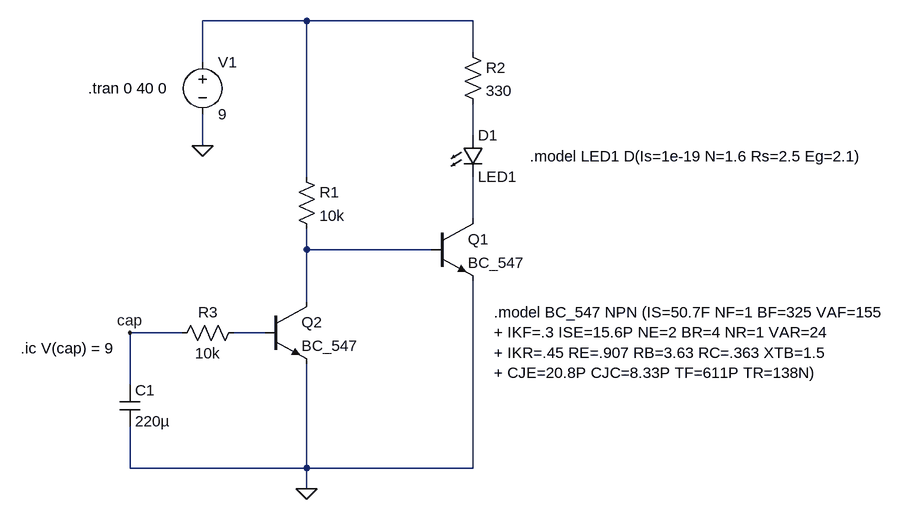
[diagram p0: schematic transistor.asc]
transistor.asc, the LTspice schematic file:
Version 4.1
SHEET 1 1156 680
WIRE 224 -384 64 -384
WIRE 480 -384 224 -384
WIRE 480 -336 480 -384
WIRE 64 -320 64 -384
WIRE 480 -208 480 -256
WIRE 64 -192 64 -240
WIRE 224 -144 224 -384
WIRE 480 -80 480 -144
WIRE 224 -32 224 -64
WIRE 416 -32 224 -32
WIRE 224 48 224 -32
WIRE 32 96 -48 96
WIRE 160 96 112 96
WIRE -48 176 -48 96
WIRE -48 304 -48 240
WIRE 224 304 224 144
WIRE 224 304 -48 304
WIRE 480 304 480 16
WIRE 480 304 224 304
WIRE 224 336 224 304
FLAG 224 336 0
FLAG 64 -192 0
FLAG -48 96 cap
SYMBOL LED 464 -208 R0
SYMATTR InstName D1
SYMATTR Value LED1
SYMBOL res 208 -160 R0
SYMATTR InstName R1
SYMATTR Value 10k
SYMBOL res 464 -352 R0
SYMATTR InstName R2
SYMATTR Value 330
SYMBOL res 128 80 R90
WINDOW 0 0 56 VBottom 2
WINDOW 3 32 56 VTop 2
SYMATTR InstName R3
SYMATTR Value 10k
SYMBOL cap -64 176 R0
SYMATTR InstName C1
SYMATTR Value 220µ
SYMBOL voltage 64 -336 R0
SYMATTR InstName V1
SYMATTR Value 9
SYMBOL npn 416 -80 R0
SYMATTR InstName Q1
SYMATTR Value BC_547
SYMBOL npn 160 48 R0
SYMATTR InstName Q2
SYMATTR Value BC_547
TEXT 568 -176 Left 2 !.model LED1 D(Is=1e-19 N=1.6 Rs=2.5 Eg=2.1)
TEXT -216 120 Left 2 !.ic V(cap) = 9
TEXT -112 -280 Left 2 !.tran 0 40 0
TEXT 512 64 Left 2 !.model BC_547 NPN (IS=50.7F NF=1 BF=325 VAF=155\n+ IKF=.3 ISE=15.6P NE=2 BR=4 NR=1 VAR=24\n+ IKR=.45 RE=.907 RB=3.63 RC=.363 XTB=1.5\n+ CJE=20.8P CJC=8.33P TF=611P TR=138N)

The netlist it stands for:
* transistor.asc
D1 N002 N003 LED1
R1 N001 N004 10k
R2 N001 N002 330
R3 N005 cap 10k
C1 cap 0 220µ
V1 N001 0 9
Q1 N003 N004 0 0 BC_547
Q2 N004 N005 0 0 BC_547
.model D D
.lib standard.dio
.model NPN NPN
.model PNP PNP
.lib standard.bjt
.model LED1 D(Is=1e-19 N=1.6 Rs=2.5 Eg=2.1)
.ic V(cap) = 9
.tran 0 40 0
.model BC_547 NPN (IS=50.7F NF=1 BF=325 VAF=155
+ IKF=.3 ISE=15.6P NE=2 BR=4 NR=1 VAR=24
+ IKR=.45 RE=.907 RB=3.63 RC=.363 XTB=1.5
+ CJE=20.8P CJC=8.33P TF=611P TR=138N)
.backanno
.end